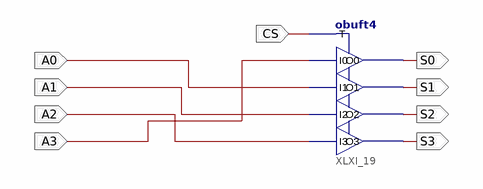
[diagram p0: schematic sheet 1]
// Xilinx ISE schematic ShiftLX4.sch (spartan3e) as structural Verilog: 1 symbols, 9 ports
module ShiftLX4 (
  input  A2,
  input  A3,
  input  CS,
  input  A0,
  input  A1,
  output S0,
  output S1,
  output S2,
  output S3
);

  obuft4 XLXI_19 (.I0(A3), .I1(A0), .I2(A1), .I3(A2), .T(CS), .O0(S0), .O1(S1), .O2(S2), .O3(S3));
endmodule
